# EAGLE design Resistor_ladder (EAGLE 9.5.1)
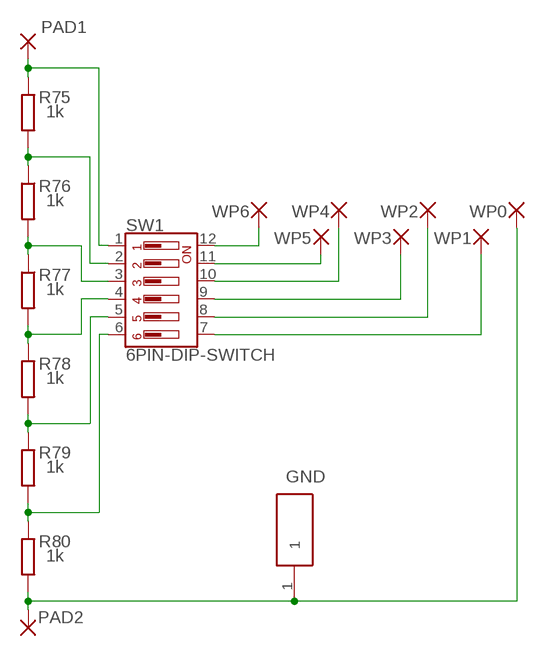
[diagram p0: schematic, sheet 1]

## Parts
GND  5000  [5000]
PAD1  SMD_PAD  [SMD_PAD]
PAD2  SMD_PAD  [SMD_PAD]
R75  1k  R-EU0603  [R0603]
R76  1k  R-EU0603  [R0603]
R77  1k  R-EU0603  [R0603]
R78  1k  R-EU0603  [R0603]
R79  1k  R-EU0603  [R0603]
R80  1k  R-EU0603  [R0603]
SW1  6PIN-DIP-SWITCH  [DIPSWITCH-06]
WP0  2,54/1,1  [2,54/1,1]
WP1  2,54/1,1  [2,54/1,1]
WP2  2,54/1,1  [2,54/1,1]
WP3  2,54/1,1  [2,54/1,1]
WP4  2,54/1,1  [2,54/1,1]
WP5  2,54/1,1  [2,54/1,1]
WP6  2,54/1,1  [2,54/1,1]

## Nets
N$4: SW1.12 WP6.1(P)
N$5: SW1.11 WP5.1(P)
N$6: R77.2 R78.1 SW1.4
N$7: SW1.10 WP4.1(P)
N$8: R76.2 R77.1 SW1.3
N$9: R75.2 R76.1 SW1.2
N$10: PAD1.1(P) R75.1 SW1.1
N$11: GND.1 PAD2.1(P) R80.2 WP0.1(P)
N$13: R79.2 R80.1 SW1.6
N$14: R78.2 R79.1 SW1.5
N$15: SW1.9 WP3.1(P)
N$16: SW1.8 WP2.1(P)
N$17: SW1.7 WP1.1(P)

## Library data of the parts
GND = testing:5000
PAD1 PAD2 = testing:SMD_PAD: SMD PAD
R75-R80 = Resistors:R-EU
SW1 = buttons and switches:6PIN-DIP-SWITCH
WP0 WP1-WP6 = wirepad:2,54/1,1: THROUGH-HOLE PAD

## Board
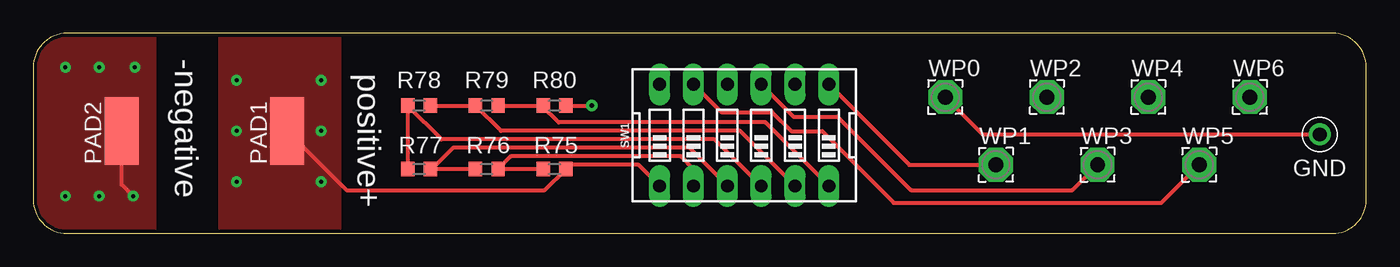
[diagram p1: board, top side]
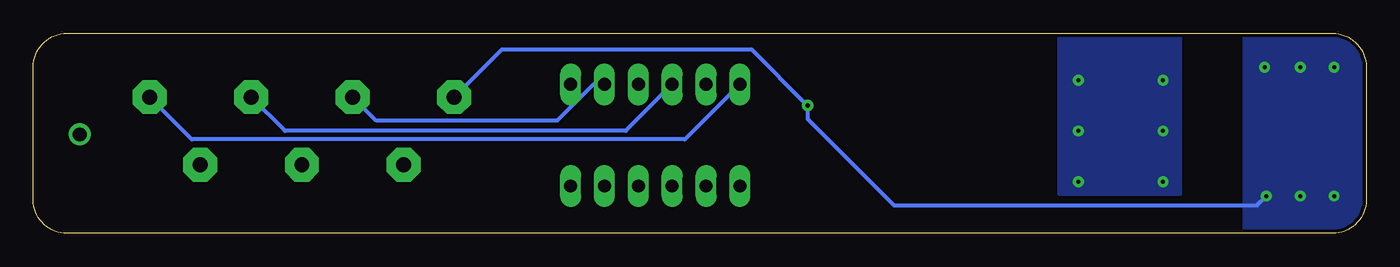
[diagram p2: board, bottom side, seen from below]

Size 100 x 15 mm. Coordinates in mm from the lower left corner, seen from the top.
Outline: 0,12.5 0,2.5 arc90 2.5,0 97.5,0 arc90 100,2.5 100,12.5 arc90 97.5,15 2.5,15 arc90 0,12.5
Copper layers (1+2*15+16): Top 0.035mm / dielectric 0.11mm / Route2 0.035mm / dielectric 1.13mm / Route15 0.035mm / dielectric 0.11mm / Bottom 0.035mm
Design rules "Pcb_Way_design_rules": minimum track width 6mil, minimum drill 0.3mm, track to track 6mil, track to pad 6mil, pad to pad 6mil, via to via 6mil, smd to smd 6mil, copper to edge 10mil, drill to drill 8mil, minimum pad ring 12mil, minimum via ring 10mil, stop-mask expansion 4mil, vias tented up to drill 25mil, thermal gap 10mil

### Footprints (pad centres in the part's own frame; a part is rotated, then mirrored left to right if it is on the bottom)
5000 = drill 1.02 pad 1.6: 1 0,0
SMD_PAD = smd 2.54 x 5.08: 1 0,0
R0603 = smd 1 x 1.1: 1 -0.85,0; 2 0.85,0
DIPSWITCH-06 = drill 0.97 long: 1 -8.89,-3.81; 2 -6.35,-3.81; 3 -3.81,-3.81; 4 -1.27,-3.81; 5 1.27,-3.81; 6 3.81,-3.81; 7 3.81,3.81; 8 1.27,3.81; 9 -1.27,3.81; 10 -3.81,3.81; 11 -6.35,3.81; 12 -8.89,3.81
2,54/1,1 = drill 1.118 pad 2.54 octagon: 1 0,0

### Placement (x,y rotation side)
GND  96.52,7.43 0 top
PAD1  19.05,7.68 0 top
PAD2  6.62,7.68 0 top
R75  39.1,4.82 180 top
R76  34.02,4.82 180 top
R77  28.94,4.82 180 top
R78  28.94,9.59 0 top
R79  34.02,9.59 0 top
R80  39.1,9.59 0 top
SW1  55.88,7.36 0 top
WP0  68.42,10.22 0 top
WP1  72.23,5.14 0 top
WP2  76.04,10.22 0 top
WP3  79.85,5.14 0 top
WP4  83.66,10.22 0 top
WP5  87.47,5.14 0 top
WP6  91.28,10.22 0 top

### Tracks (layer width: path | path; a pad name or v marks a point on that pad's centre or on a via)
N$4
  Bottom 0.305: SW1.12 51.12,7.04 88.11,7.04 WP6.1
N$5
  Top 0.305: SW1.11 51.61,9.09 55.43,9.09 56.87,7.66 59.19,7.66 64.57,2.28 84.61,2.28 WP5.1
N$6
  Top 0.305: 28.09,10.01 R78.1 | SW1.4 51.12,7.04 30.63,7.04 R78.1 | R78.1 R77.2
N$7
  Bottom 0.305: SW1.10 55.56,7.68 81.12,7.68 WP4.1
N$8
  Top 0.305: R76.2 R77.1 29.89,4.82 31.48,6.41 49.21,6.41 SW1.3
N$9
  Top 0.305: R75.2 R76.1 35.82,5.78 48.58,5.78 49.53,4.82 SW1.2
N$10  (via drill 0.3)
  Top 0.305: SW1.1 45.4,5.14 40.27,5.14 R75.1 38.36,3.23 23.5,3.23 PAD1.1
  other vias: 15.24,11.49 15.24,3.87 15.24,7.68 21.59,11.49 21.59,7.68 21.59,3.87
  pour Top (no thermals): 13.97,15.03 23.02,15.03 23.02,-0.3 13.97,-0.3
  pour Bottom (no thermals): 13.97,15.03 13.97,2.95 23.02,2.95 23.02,15.03
N$11  (via drill 0.3, 0.35)
  Top 0.305: R80.2 v41.91,9.59 | v7.49,2.8 6.62,3.67 PAD2.1 | WP0.1 71.21,7.43 GND.1
  Bottom 0.305: WP0.1 64.84,13.79 46.12,13.79 v41.91,9.59 41.91,8.59 35.42,2.09 8.2,2.09 v7.49,2.8
  other vias: 4.95,2.8 2.41,2.8 2.41,12.45 4.95,12.45 7.62,12.45
  pour Top (no thermals): -0.36,15.03 9.16,15.03 9.16,-0.3 -0.36,-0.3
  pour Bottom (no thermals): -0.36,15.03 9.16,15.03 9.16,-0.3 -0.36,-0.3
N$13
  Top 0.305: R79.2 38.15,9.59 | 38.15,9.59 R80.1 | SW1.6 54.93,8.31 39.42,8.31 38.15,9.59
N$14
  Top 0.305: R78.2 R79.1 35.08,7.68 53.02,7.68 SW1.5
N$15
  Top 0.305: SW1.9 57.03,8.75 60.33,8.75 65.85,3.23 77.94,3.23 WP3.1
N$16
  Bottom 0.305: SW1.8 57.99,11.17 60.7,8.46 74.28,8.46 WP2.1
N$17
  Top 0.305: SW1.7 65.72,5.14 WP1.1

### Text on the board
tNames: -negative | positive+